# EAGLE design untitled (EAGLE 6.5.0)
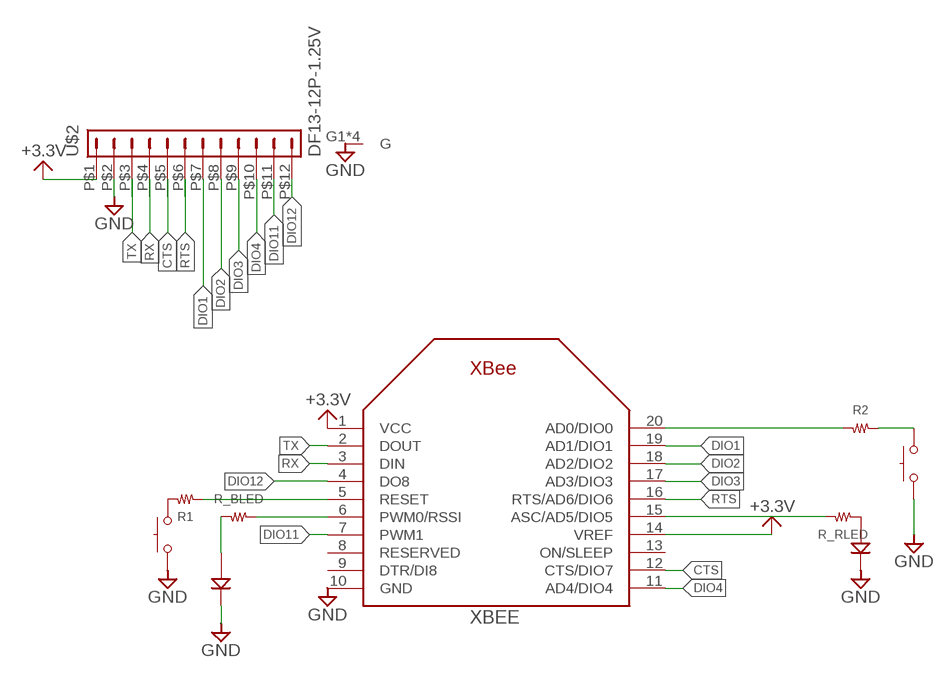
[diagram p0: schematic, sheet 1]

## Parts
COMM  SKRPACE010  [SKRP]
LED_B  1608  [1608]
LED_R  1608  [1608]
R1  RESISTOR__SMD  [1608]
R2  RESISTOR__SMD  [1608]
R_BLED  RESISTOR__SMD  [1608]
R_RLED  RESISTOR__SMD  [1608]
RESET  SKRPACE010  [SKRP]
U$2  DF13-12P-1.25V  [DF13C-12P-1.25V]
XBEE  XBEE  [XBEE]

## Nets
+3.3V: U$2.P$1 XBEE.1(VCC) XBEE.14(VREF)
CTS: U$2.P$5 XBEE.12(CTS/DIO7)
DIO1: U$2.P$7 XBEE.19(AD1/DIO1)
DIO2: U$2.P$8 XBEE.18(AD2/DIO2)
DIO3: U$2.P$9 XBEE.17(AD3/DIO3)
DIO4: U$2.P$10 XBEE.11(AD4/DIO4)
DIO11: U$2.P$11 XBEE.7(PWM1)
DIO12: U$2.P$12 XBEE.4(DO8)
GND: COMM.3 COMM.4 LED_B.2(K) LED_R.2(K) RESET.3 RESET.4 U$2.G1(G) U$2.G2(G) U$2.M$0(G) U$2.M$1(G) U$2.P$2 XBEE.10(GND)
N$2: LED_R.1(A) R_RLED.1
N$3: R2.1 XBEE.20(AD0/DIO0)
N$4: R1.1 XBEE.5(RESET)
N$5: R1.2 RESET.1 RESET.2
N$6: COMM.1 COMM.2 R2.2
N$7: R_BLED.2 XBEE.6(PWM0/RSSI)
N$8: R_RLED.2 XBEE.15(ASC/AD5/DIO5)
N$9: LED_B.1(A) R_BLED.1
RTS: U$2.P$6 XBEE.16(RTS/AD6/DIO6)
RX: U$2.P$4 XBEE.3(DIN)
TX: U$2.P$3 XBEE.2(DOUT)
Unconnected: XBEE.8(RESERVED) XBEE.9(DTR/DI8) XBEE.13(ON/SLEEP)

## Library data of the parts
COMM RESET = 09_1_switch:SKRPACE010
LED_B LED_R = 10_LED:1608
R1 R2 R_BLED R_RLED = 01_R:RESISTOR__SMD
U$2 = con-hirose-df13:DF13-12P-1.25: DF13-12P 1.25mm Pitch Miniature Crimping Connector.
XBEE = adafruit:XBEE

## Board
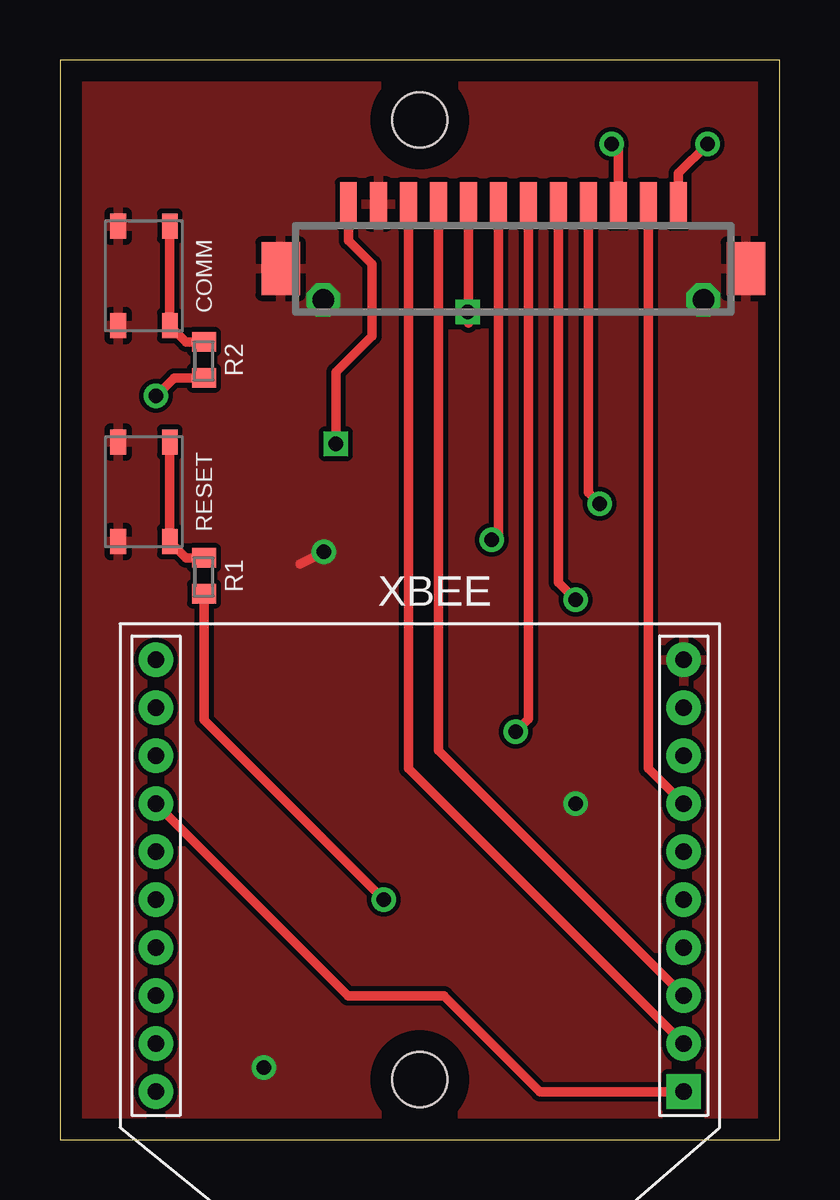
[diagram p1: board, top side]
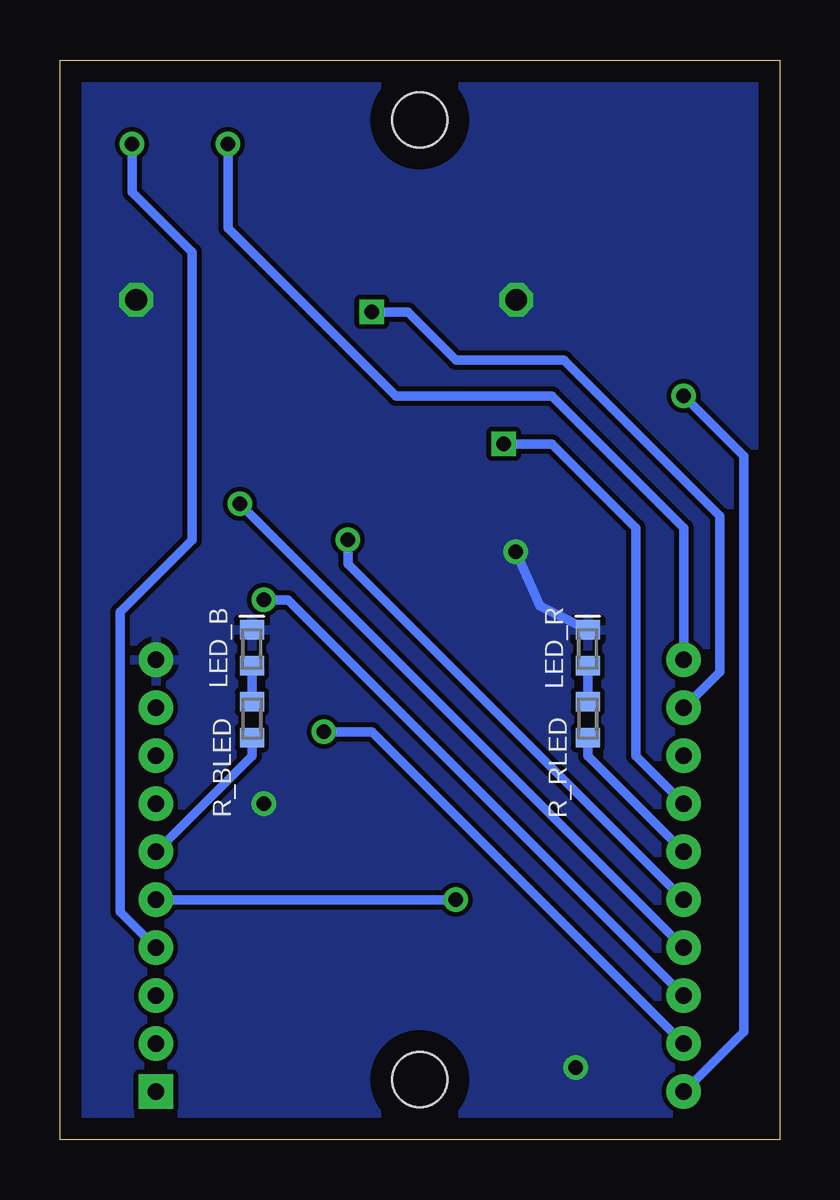
[diagram p2: board, bottom side, seen from below]

Size 30 x 45 mm. Coordinates in mm from the lower left corner, seen from the top.
Outline: 0,0 30,0 30,45 0,45 0,0
Copper layers (1*16): Top 0.035mm / dielectric 1.5mm / Bottom 0.035mm
Design rules "default *": minimum track width 10mil, minimum drill 20mil, track to track 8mil, track to pad 8mil, pad to pad 8mil, via to via 8mil, smd to smd 8mil, copper to edge 0.9mm, drill to drill 8mil, minimum pad ring 10mil, minimum via ring 8mil, stop-mask expansion 4mil, vias tented up to drill 0mil, thermal gap 10mil
Holes 2.3 mm at 15,2.5 15,42.5

### Footprints (pad centres in the part's own frame; a part is rotated, then mirrored left to right if it is on the bottom)
SKRP = smd 1.05 x 0.65: 1 -2.075,1.075; 2 2.075,1.075; 3 -2.075,-1.075; 4 2.075,-1.075
1608 = smd 0.8 x 1: 1 -0.75,0; 2 0.75,0
DF13C-12P-1.25V = drill 0.9 octagon: G1 -7.925,-1.3; G2 7.925,-1.3 | smd 1.6 x 2.2: M$0 9.7,0; M$1 -9.7,0 | smd 0.7 x 1.8: P$1 -6.875,2.7; P$2 -5.625,2.7; P$3 -4.375,2.7; P$4 -3.125,2.7; P$5 -1.875,2.7; P$6 -0.625,2.7; P$7 0.625,2.7; P$8 1.875,2.7; P$9 3.125,2.7; P$10 4.375,2.7; P$11 5.625,2.7; P$12 6.875,2.7
XBEE = drill 0.7 pad 1.422 square: 1 -11,5.5 | drill 0.7 pad 1.422: 2 -11,3.5; 3 -11,1.5; 4 -11,-0.5; 5 -11,-2.5; 6 -11,-4.5; 7 -11,-6.5; 8 -11,-8.5; 9 -11,-10.5; 10 -11,-12.5; 11 11,-12.5; 12 11,-10.5; 13 11,-8.5; 14 11,-6.5; 15 11,-4.5; 16 11,-2.5; 17 11,-0.5; 18 11,1.5; 19 11,3.5; 20 11,5.5

### Placement (x,y rotation side)
COMM  3.5,36 270 top
LED_B  22,20.5 90 bottom
LED_R  8,20.5 90 bottom
R1  6,23.5 90 top
R2  6,32.5 90 top
R_BLED  22,17.5 270 bottom
R_RLED  8,17.5 270 bottom
RESET  3.5,27 270 top
U$2  18.9,36.3 0 top
XBEE  15,7.5 180 top

### Tracks (layer width: path | path; a pad name or v marks a point on that pad's centre or on a via)
+3.3V  (via drill 0.6)
  Top 0.4: v11.5,29 11.5,32 13,33.5 13,36.5 12.03,37.48 U$2.P$1 | XBEE.1 20,2 16,6 12,6 XBEE.14
  Bottom 0.4: XBEE.14 6,16 6,25.5 9.5,29 v11.5,29
CTS  (via drill 0.6)
  Top 0.4: v17,34.5 17.02,34.02 U$2.P$5
  Bottom 0.4: XBEE.12 2.5,19.5 2.5,26 9,32.5 13.5,32.5 15.5,34.5 v17,34.5
DIO1  (via drill 0.6)
  Top 0.4: v19,17 19.52,17.52 U$2.P$7
  Bottom 0.4: XBEE.19 17,17 v19,17
DIO2  (via drill 0.6)
  Top 0.4: v21.5,22.5 20.77,23.23 U$2.P$8
  Bottom 0.4: XBEE.18 20.5,22.5 v21.5,22.5
DIO3  (via drill 0.6)
  Top 0.4: v22.5,26.5 22.02,26.98 U$2.P$9
  Bottom 0.4: XBEE.17 v22.5,26.5
DIO4  (via drill 0.6)
  Top 0.4: v23,41.5 23.27,41.23 U$2.P$10
  Bottom 0.4: v23,41.5 23,38 16,31 9.5,31 4,25.5 XBEE.11
DIO11
  Top 0.4: XBEE.7 24.52,15.47 U$2.P$11
DIO12  (via drill 0.6)
  Top 0.4: U$2.P$12 25.77,40.27 v27,41.5
  Bottom 0.4: v27,41.5 27,39.5 24.5,37 24.5,25 27.5,22 27.5,9.5 XBEE.4
GND  (via drill 0.6)
  Top 0.4: v11,24.5 10,24
  Bottom 0.4: LED_R.2 10,22.25 v11,24.5
  other vias: 8.5,3 21.5,14
  pour Top: 0,45 30,45 30,0 0,0
  pour Bottom: 0,45 30,45 30,0 0,0
N$2
  Bottom 0.4: R_RLED.1 LED_R.1
N$3  (via drill 0.6)
  Top 0.4: v4,31 4.75,31.75 R2.1
  Bottom 0.4: XBEE.20 1.5,4.5 1.5,28.5 v4,31
N$4  (via drill 0.6)
  Top 0.4: v13.5,10 6,17.5 R1.1
  Bottom 0.4: XBEE.5 v13.5,10
N$5
  Top 0.4: RESET.1 RESET.2 5.25,24.25 R1.2
N$6
  Top 0.4: COMM.1 COMM.2 5.25,33.25 R2.2
N$7
  Bottom 0.4: XBEE.6 22,16 R_BLED.2
N$8
  Bottom 0.4: XBEE.15 8,16 R_RLED.2
N$9
  Bottom 0.4: R_BLED.1 LED_B.1
RTS  (via drill 0.6)
  Top 0.4: v18,25 18.27,25.27 U$2.P$6
  Bottom 0.4: XBEE.16 18,24 v18,25
RX
  Top 0.4: U$2.P$4 15.78,16.23 XBEE.3
TX
  Top 0.4: U$2.P$3 14.53,15.47 XBEE.2